# EAGLE design shield_scaffold (EAGLE 6.0)
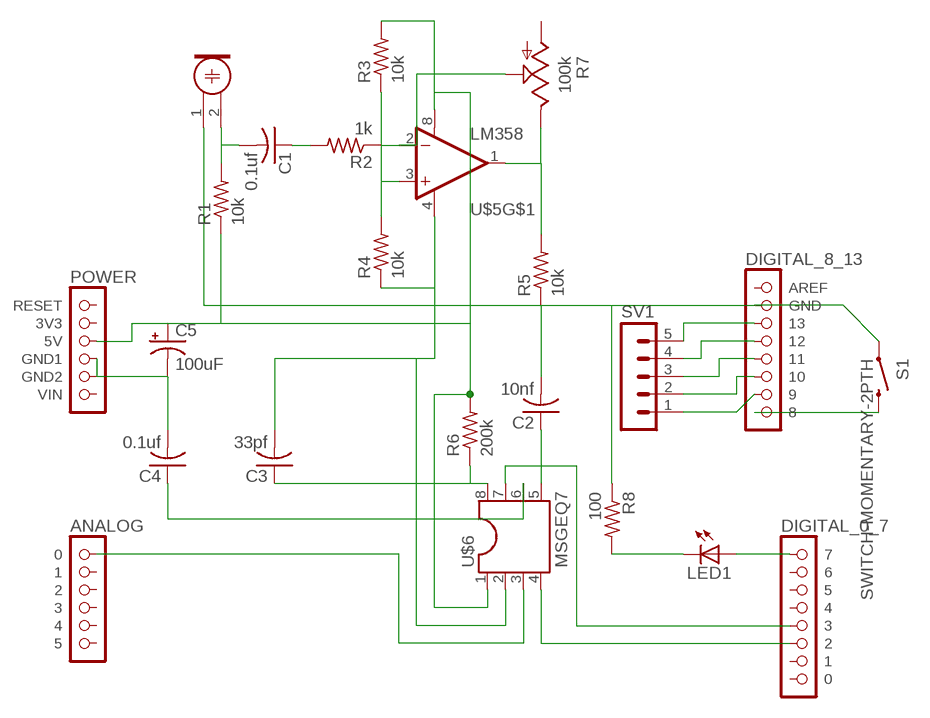
[diagram p0: schematic, sheet 1]

## Parts
C1  0.1uf  C-US050-030X075  [C050-030X075]
C2  10nf  C-US050-030X075  [C050-030X075]
C3  33pf  C-US050-030X075  [C050-030X075]
C4  0.1uf  C-US050-030X075  [C050-030X075]
C5  100uF  CPOL-USE3.5-8  [E3,5-8]
LED1  LED3MM  [LED3MM]
M1  ELECTRET_MICROPHON-F6050AP  [F6050AP]
R1  10k  R-US_0207/10  [0207/10]
R2  1k  R-US_0207/10  [0207/10]
R3  10k  R-US_0207/10  [0207/10]
R4  10k  R-US_0207/10  [0207/10]
R5  10k  R-US_0207/10  [0207/10]
R6  200k  R-US_0207/10  [0207/10]
R7  100k  TRIM_US-PT-10  [PT-10]
R8  100  R-US_0207/10  [0207/10]
S1  SWITCH-MOMENTARY-2PTH  [TACTILE-PTH]
SV1  MA05-1  [MA05-1]
U$1  POWER  [1X06]
U$2  ANALOG  [1X06]
U$3  DIGITAL_0_7  [1X08]
U$4  DIGITAL_8_13  [1X08]
U$5  LM358  [DIP08]
U$6  MSGEQ7  [SOCKET-08]

## Nets
GND: C3.2 M1.1 R4.1 R8.1 S1.1 U$4.2(GND) U$5.4(V-) U$6.2
N$1: C1.2 M1.2 R1.2
N$2: C1.1 R2.2
N$3: C4.1 U$6.6
N$4: R2.1 R7.S U$5.2(-IN)
N$5: S1.3 U$4.8
N$6: R3.1 R4.2 U$5.3(+IN)
N$7: R5.2 R7.E U$5.1(OUT)
N$8: C2.2 R5.1
N$9: C2.1 U$6.5
N$10: LED1.A U$3.1
N$11: SV1.5 U$4.3
N$12: U$2.1 U$6.3
N$13: U$3.6 U$6.4
N$14: C3.1 R6.1 U$6.8
N$15: U$3.5 U$6.7
N$17: SV1.4 U$4.4
N$18: SV1.3 U$4.5
N$19: SV1.2 U$4.6
N$20: SV1.1 U$4.7
N$21: LED1.K(C) R8.2
N$23: C4.2 C5.- U$1.4(GND1) U$1.5(GND2)
N$24: C5.+ R1.1 R3.2 R6.2 U$1.3(5V) U$5.8(V+) U$6.1
Unconnected: R7.A U$1.1(RESET) U$1.2(3V3) U$1.6(VIN) U$2.2 U$2.3 U$2.4 U$2.5 U$2.6 U$3.2 U$3.3 U$3.4 U$3.7 U$3.8 U$4.1(AREF) U$5.5(+IN) U$5.6(-IN) U$5.7(OUT)

## Library data of the parts
C1-C4 = resistor:C-US: CAPACITOR, American symbol
C5 = resistor:CPOL-US: POLARIZED CAPACITOR, American symbol
LED1 = led:LED: LED OSRAM: - CHIPLED LG R971, LG N971, LY N971, LG Q971, LY Q971, LO R971, LY R971 LH N974, LH R974 LS Q976, LO Q976, LY Q976 LO Q996 - Hyper CHIPLED LW Q18S LB Q993, LB Q99A, LB R99A - SideLED LS A670, LO A670, LY A670, LG A670, LP A670 LB A673, LV A673, LT A673, LW A673 LH A674 LY A675 LS A676, LA A676, LO A676, LY A676, LW A676 LS A679, LY A679, LG A679 - Hyper Micro SIDELED® LS Y876, LA Y876, LO Y876, LY Y876 LT Y87S - SmartLED LW L88C, LW L88S LB L89C, LB L89S, LG L890 LS L89K, LO L89K, LY L89K LS L896, LA L896, LO L896, LY L896 - TOPLED LS T670, LO T670, LY T670, LG T670, LP T670 LSG T670, LSP T670, LSY T670, LOP T670, LYG T670 LG T671, LOG T671, LSG T671 LB T673, LV T673, LT T673, LW T673 LH T674 LS T676, LA T676, LO T676, LY T676, LB T676, LH T676, LSB T676, LW T676 LB T67C, LV T67C, LT T67C, LS T67K, LO T67K, LY T67K, LW E67C LS E67B, LA E67B, LO E67B, LY E67B, LB E67C, LV E67C, LT E67C LW T67C LS T679, LY T679, LG T679 LS T770, LO T770, LY T770, LG T770, LP T770 LB T773, LV T773, LT T773, LW T773 LH T774 LS E675, LA E675, LY E675, LS T675 LS T776, LA T776, LO T776, LY T776, LB T776 LHGB T686 LT T68C, LB T68C - Hyper Mini TOPLED® LB M676 - Mini TOPLED Santana® LG M470 LS M47K, LO M47K, LY M47K Source: http://www.osram.convergy.de LUXEON: - LUMILED® LXK2-PW12-R00, LXK2-PW12-S00, LXK2-PW14-U00, LXK2-PW14-V00 LXK2-PM12-R00, LXK2-PM12-S00, LXK2-PM14-U00 LXK2-PE12-Q00, LXK2-PE12-R00, LXK2-PE12-S00, LXK2-PE14-T00, LXK2-PE14-U00 LXK2-PB12-K00, LXK2-PB12-L00, LXK2-PB12-M00, LXK2-PB14-N00, LXK2-PB14-P00, LXK2-PB14-Q00 LXK2-PR12-L00, LXK2-PR12-M00, LXK2-PR14-Q00, LXK2-PR14-R00 LXK2-PD12-Q00, LXK2-PD12-R00, LXK2-PD12-S00 LXK2-PH12-R00, LXK2-PH12-S00 LXK2-PL12-P00, LXK2-PL12-Q00, LXK2-PL12-R00 Source: www.luxeon.com KINGBRIGHT: KA-3528ASYC Source: www.kingbright.com
M1 = microphon:ELECTRET_MICROPHON-: Electret Condenser Microphone
R1-R6 R8 = resistor:R-US_: RESISTOR, American symbol
R7 = pot:TRIM_US-: POTENTIOMETER
S1 = SparkFun:SWITCH-MOMENTARY-2
SV1 = con-lstb:MA05-1: PIN HEADER; OC_FARNELL: unknown; OC_NEWARK: unknown
U$1 = arduino:POWER
U$2 = arduino:ANALOG
U$3 = arduino:DIGITAL_0_7
U$4 = arduino:DIGITAL_8_13
U$5 = SparkFun:LM358
U$6 = RobThePyro:MSGEQ7

## Board
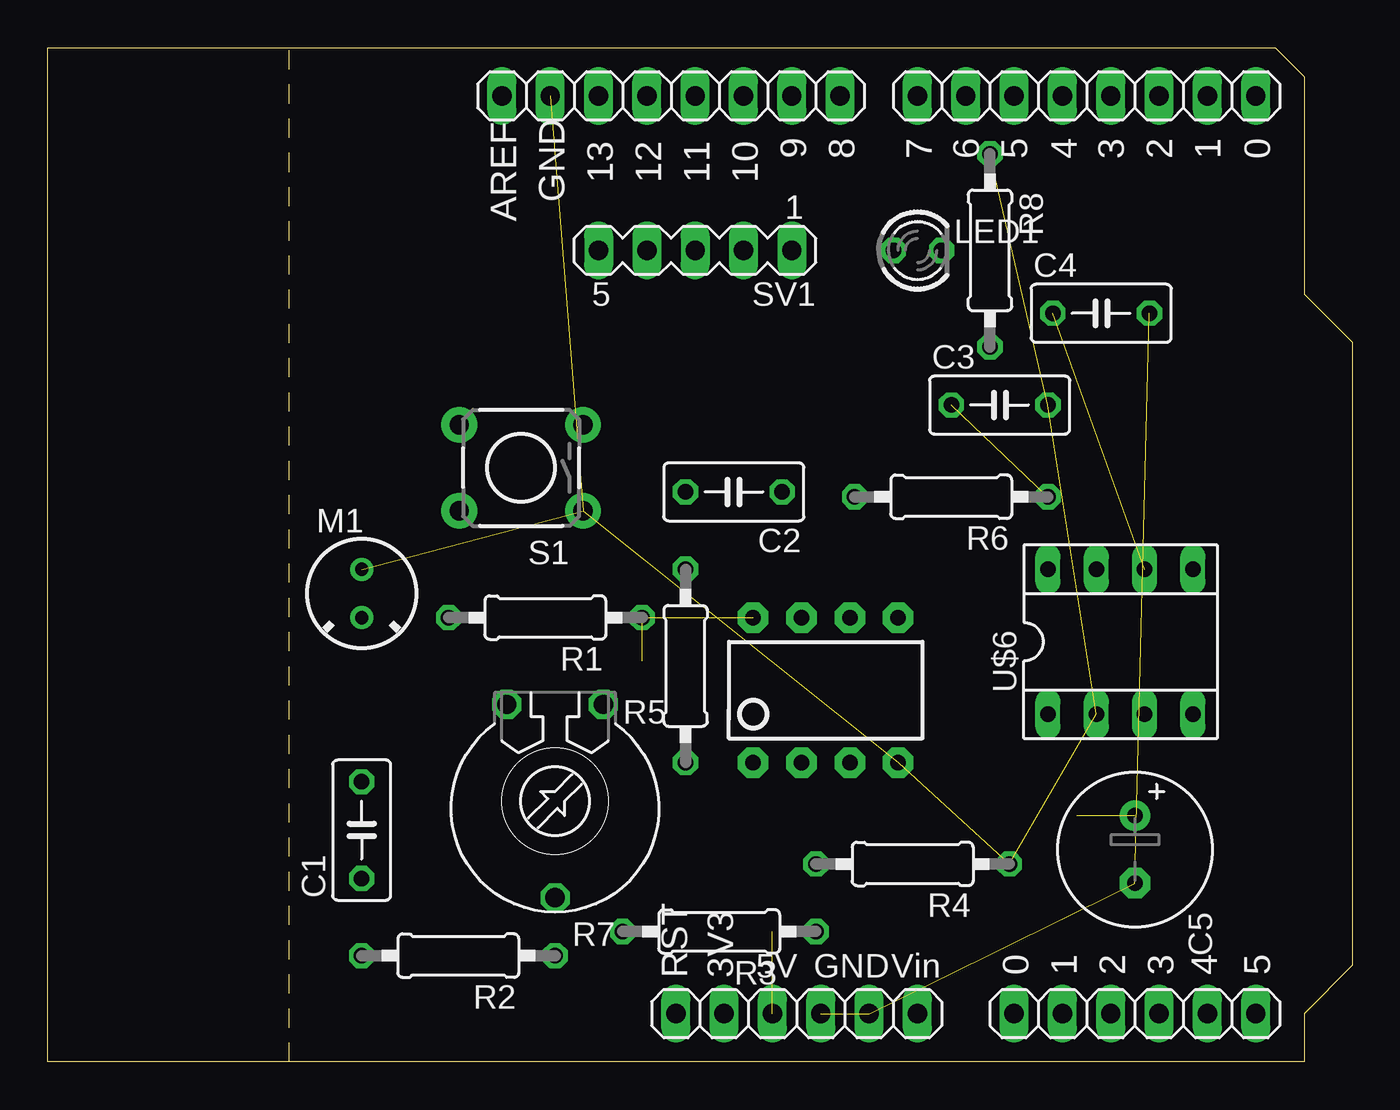
[diagram p1: board, top side]
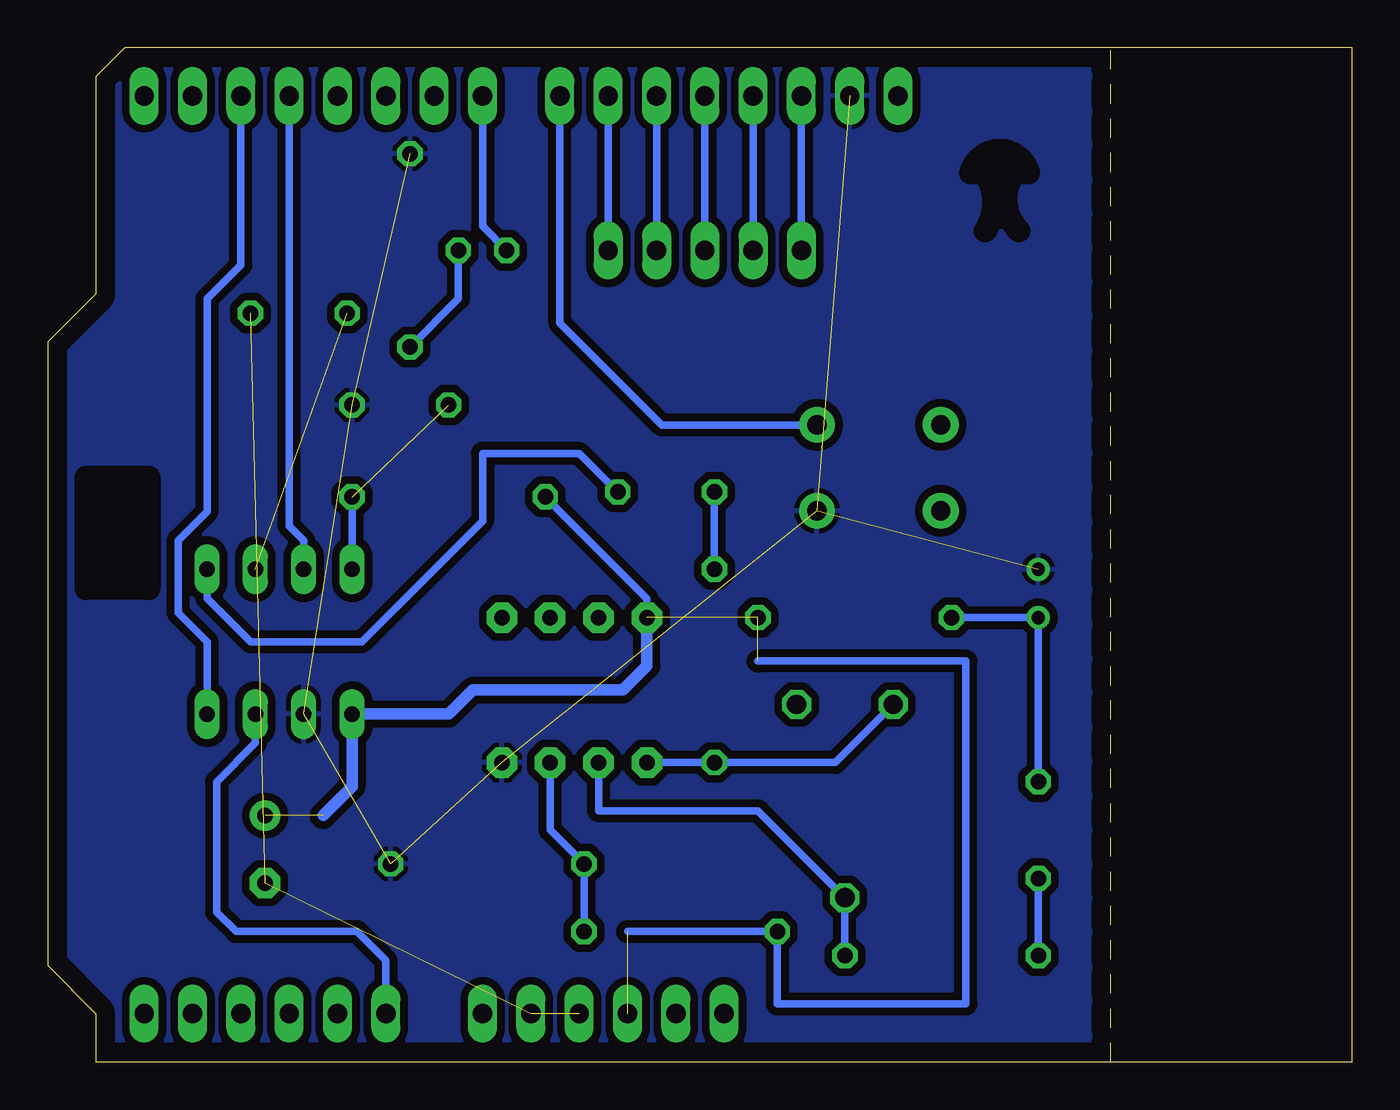
[diagram p2: board, bottom side, seen from below]

Size 68.58 x 53.34 mm. Coordinates in mm from the lower left corner, seen from the top.
Outline: 12.7,53.34 0,53.34 0,0 12.7,0
Outline: 12.7,53.34 64.52,53.34 66.04,51.82 66.04,40.39 68.58,37.85 68.58,5.08 66.04,2.54 66.04,0 12.7,0
Outline: 12.7,0 12.7,53.34
Copper layers (1*16): Top 0.035mm / dielectric 1.5mm / Bottom 0.035mm
Design rules: minimum track width 10mil, minimum drill 24mil, track to track 8mil, track to pad 8mil, pad to pad 8mil, via to via 8mil, smd to smd 8mil, copper to edge 40mil, drill to drill 8mil, minimum pad ring 10mil, minimum via ring 8mil, stop-mask expansion 4mil, vias tented up to drill 0mil, thermal gap 10mil
bRestrict: 10 lines

### Footprints (pad centres in the part's own frame; a part is rotated, then mirrored left to right if it is on the bottom)
C050-030X075 = drill 0.813 octagon: 1 -2.54,0; 2 2.54,0
E3,5-8 = drill 0.813 pad 1.6: + -1.778,0 | drill 0.813 pad 1.6 octagon: - 1.778,0
LED3MM = drill 0.813 octagon: A -1.27,0; K 1.27,0
F6050AP = drill 0.7 pad 1.2: 1 0,1.27; 2 0,-1.27
0207/10 = drill 0.813 octagon: 1 -5.08,0; 2 5.08,0
PT-10 = drill 1.016 octagon: A -2.54,-5.08; E 2.54,-5.08; S 0,5.08
TACTILE-PTH = drill 1.016 pad 1.88: 1 -3.251,2.261; 2 3.251,2.261; 3 -3.251,-2.261; 4 3.251,-2.261
MA05-1 = drill 1.016 long: 1 -5.08,0; 2 -2.54,0; 3 0,0; 4 2.54,0; 5 5.08,0
1X06 = drill 1.016 long: 1 -6.35,0; 2 -3.81,0; 3 -1.27,0; 4 1.27,0; 5 3.81,0; 6 6.35,0
1X08 = drill 1.016 long: 1 -8.89,0; 2 -6.35,0; 3 -3.81,0; 4 -1.27,0; 5 1.27,0; 6 3.81,0; 7 6.35,0; 8 8.89,0
DIP08 = drill 0.813 pad 1.6 octagon: 1 -3.81,-3.81; 2 -1.27,-3.81; 3 1.27,-3.81; 4 3.81,-3.81; 5 3.81,3.81; 6 1.27,3.81; 7 -1.27,3.81; 8 -3.81,3.81
SOCKET-08 = drill 0.813 long: 1 -3.81,-3.81; 2 -1.27,-3.81; 3 1.27,-3.81; 4 3.81,-3.81; 5 3.81,3.81; 6 1.27,3.81; 7 -1.27,3.81; 8 -3.81,3.81

### Placement (x,y rotation side)
C1  16.51,12.19 90 top
C2  36.07,29.97 180 top
C3  50.04,34.54 0 top
C4  55.37,39.37 0 top
C5  57.15,11.18 270 top
LED1  45.72,42.67 0 top
M1  16.51,24.64 0 top
R1  26.16,23.37 180 top
R2  21.59,5.59 180 top
R3  35.31,6.86 180 top
R4  45.47,10.41 180 top
R5  33.53,20.83 270 top
R6  47.5,29.72 180 top
R7  26.67,13.72 180 top
R8  49.53,42.67 270 top
S1  24.89,31.24 180 top
SV1  34.04,42.67 180 top
U$1  39.37,2.54 0 top
U$2  57.15,2.54 0 top
U$3  54.61,50.8 0 top
U$4  32.77,50.8 0 top
U$5  40.89,19.56 0 top
U$6  56.39,22.1 0 top

### Tracks (layer width: path | path; a pad name or v marks a point on that pad's centre or on a via)
GND  (7 unrouted)
  pour Bottom (isolate 0.406): 0,53.34 64.52,53.34 66.04,51.82 66.04,40.39 68.58,37.85 68.58,5.08 66.04,2.54 66.04,0 0,0
N$1
  Bottom 0.406: R1.2 M1.2 C1.2
N$2
  Bottom 0.406: C1.1 R2.2
N$3  (1 unrouted)
N$4
  Bottom 0.406: R2.1 R7.S 31.24,13.21 39.62,13.21 U$5.2
N$5
  Bottom 0.406: S1.3 36.3,33.5 41.66,38.86 U$4.8
N$6
  Bottom 0.406: R3.1 R4.2 42.16,12.19 U$5.3
N$7
  Bottom 0.406: R7.E 27.18,15.75 R5.2 U$5.1
N$8
  Bottom 0.406: R5.1 C2.2
N$9
  Bottom 0.406: C2.1 40.64,32 45.72,32 45.72,28.45 52.07,22.1 57.91,22.1 60.2,24.38 U$6.5
N$10
  Bottom 0.406: U$3.1 45.72,43.94 LED1.A
N$11
  Bottom 0.406: U$4.3 SV1.5
N$12
  Bottom 0.406: U$6.3 57.66,16.76 59.69,14.73 59.69,7.87 58.67,6.86 52.32,6.86 50.8,5.33 U$2.1
N$13
  Bottom 0.406: U$6.4 60.2,22.1 61.72,23.62 61.72,27.43 60.2,28.96 60.2,40.13 58.42,41.91 U$3.6
N$14  (1 unrouted)
  Bottom 0.406: U$6.8 R6.1
N$15
  Bottom 0.406: U$6.7 55.12,27.43 55.88,28.19 U$3.5
N$17
  Bottom 0.406: U$4.4 SV1.4
N$18
  Bottom 0.406: U$4.5 SV1.3
N$19
  Bottom 0.406: U$4.6 SV1.2
N$20
  Bottom 0.406: U$4.7 SV1.1
N$21
  Bottom 0.406: LED1.K 46.99,40.13 R8.2
N$23  (3 unrouted)
N$24  (4 unrouted)
  Bottom 0.406: 31.24,21.08 20.32,21.08 20.32,3.05 30.23,3.05 R3.2 38.1,6.86 | U$5.8 37.08,24.38 R6.2
  Bottom 0.61: U$5.8 37.08,20.83 38.35,19.56 46.23,19.56 47.5,18.29 U$6.1 52.58,14.48 54.1,12.95

### Text on the board
tNames: 9 | 8 | 7 | 6 | 5 | 4 | 3 | 2 | 1 | 0 | 13 | 12 | 11 | 10 | GND | AREF | 0 | 1 | 2 | 3 | 4 | 5 | RST | 3V3 | 5V | GND | Vin
bRestrict: Rev:0.1
TallParts: USB | ISP | PWR
ArduinoHoles: 3.2mm | 2.2mm | 3.2mm